# Altium schematic sheet Interface.SchDoc
size A4
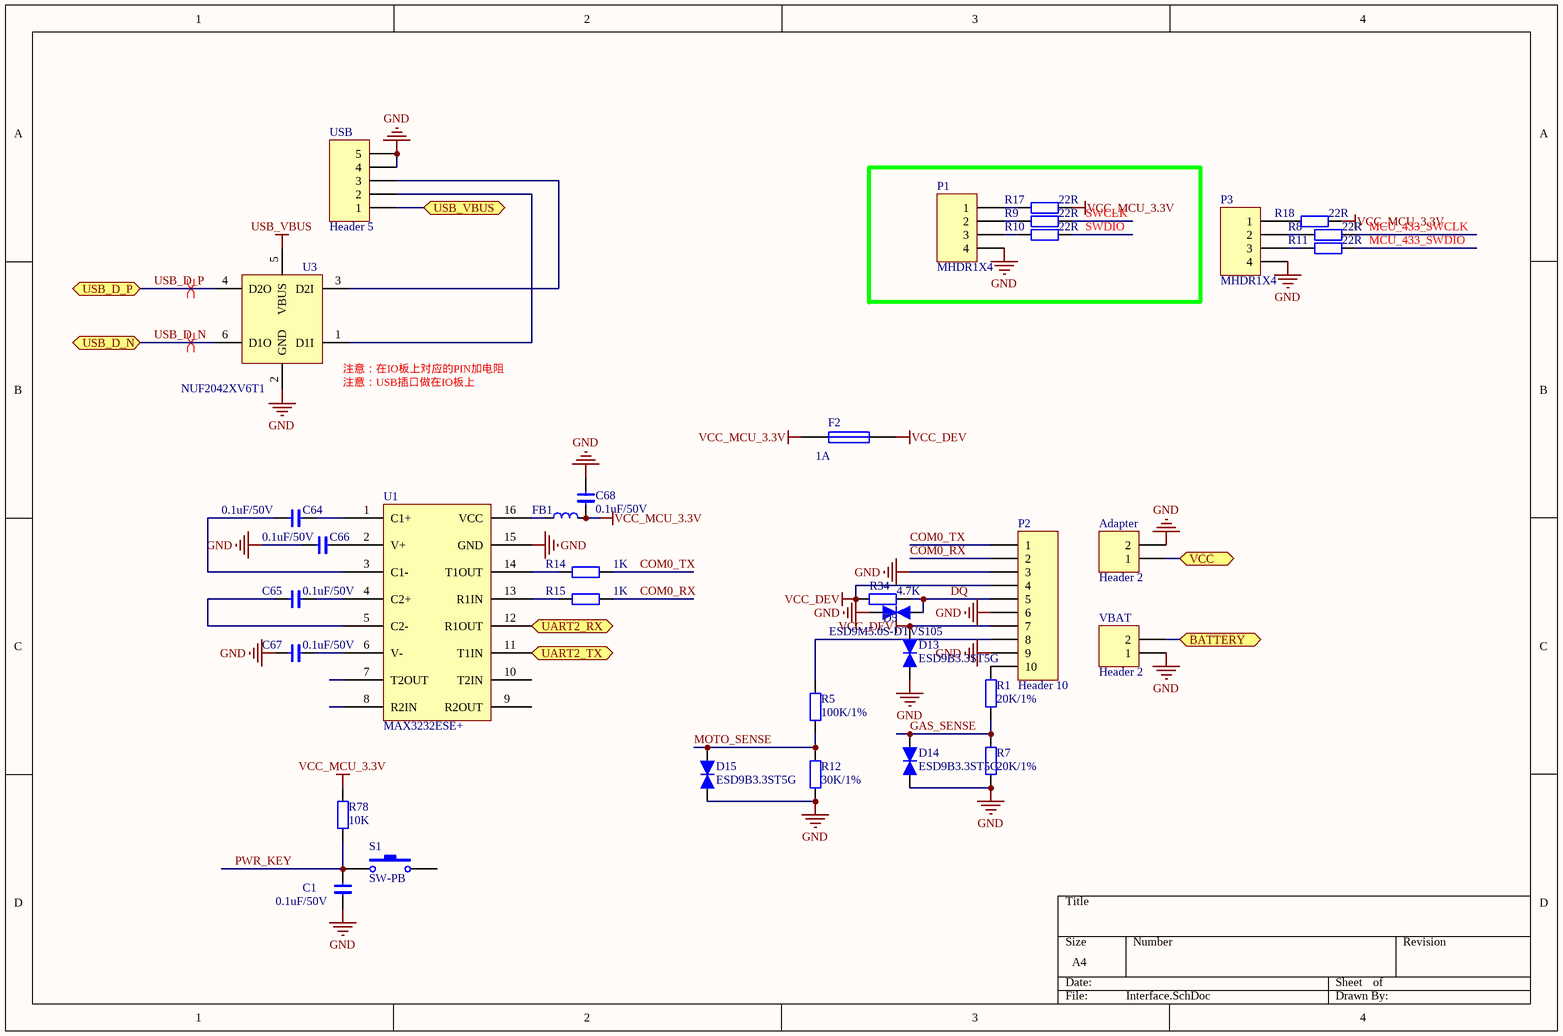
[diagram p0: Interface.SchDoc]

## Parts
Adapter  Header 2  [KF7.62-2P]
C1  0.1uF/50V  [0603C]
C64  0.1uF/50V  [0603C]
C65  0.1uF/50V  [0603C]
C66  0.1uF/50V  [0603C]
C67  0.1uF/50V  [0603C]
C68  0.1uF/50V  [0603C]
D5  ESD9M5.0S-DTVS105  [SOD923]
D13  ESD9B3.3ST5G  [SOD923]
D14  ESD9B3.3ST5G  [SOD923]
D15  ESD9B3.3ST5G  [SOD923]
F2  1A  [0805R]
FB1  (no value)  [0603R]
P1  MHDR1X4  [HDR1X4]
P2  Header 10  [10*2.54MMW]
P3  MHDR1X4  [HDR1X4]
R1  20K/1%  [0603R]
R5  100K/1%  [0603R]
R7  20K/1%  [0603R]
R8  22R  [0603R]
R9  22R  [0603R]
R10  22R  [0603R]
R11  22R  [0603R]
R12  30K/1%  [0603R]
R14  1K  [0603R]
R15  1K  [0603R]
R17  22R  [0603R]
R18  22R  [0603R]
R34  4.7K  [0603R]
R78  10K  [0603R]
S1  SW-PB  [KEY_SMT_4*4]
U1  MAX3232ESE+  [SOIC127P600X265-16N]
U3  NUF2042XV6T1  [SOT563-6]
USB  Header 5  [USB-MICRO-5P-2]
VBAT  Header 2  [2X2.54MM]

## Ports
BATTERY (bidir), UART2_RX (out), UART2_TX (in), USB_D_N, USB_D_P, USB_VBUS (bidir), VCC (bidir)

## Nets
GND: Adapter.2 C1.2 C66.2 C67.2 C68.1 D5.1(A) D13.1(A) D14.1(A) D15.1(A) P1.4 P2.3 P2.6 P2.9 P3.4 R7.1 R12.1 U1.15(GND) U3.2(GND) USB.4 USB.5 VBAT.1
USB_VBUS: U3.5(VBUS)
VCC_DEV: D13.2(K) F2.2 P2.4 P2.7 R34.2
VCC_MCU_3.3V: C68.2 F2.1 FB1.2 R17.1 R18.1 R78.1
BATTERY: VBAT.2 ; port BATTERY
COM0_RX: P2.2 R15.1
COM0_TX: P2.1 R14.1
DQ: D5.2(K) P2.5 R34.1
GAS_SENSE: D14.2(K) R1.1 R7.2
MCU_433_SWCLK: R8.1
MCU_433_SWDIO: R11.1
MOTO_SENSE: D15.2(K) R5.1 R12.2
PWR_KEY: C1.1 R78.2 S1.1
SWCLK: R9.1
SWDIO: R10.1
UART2_RX: U1.12(R1OUT) ; port UART2_RX
UART2_TX: U1.11(T1IN) ; port UART2_TX
USB_D_N: U3.6(D1O) ; port USB_D_N
USB_D_P: U3.4(D2O) ; port USB_D_P
USB_VBUS: USB.1 ; port USB_VBUS  [a separate net that carries the same name]
VCC: Adapter.1 ; port VCC
NetC64_1: C64.1 U1.1(C1+)
NetC64_2: C64.2 U1.3(C1-)
NetC65_1: C65.1 U1.4(C2+)
NetC65_2: C65.2 U1.5(C2-)
NetC66_1: C66.1 U1.2(V+)
NetC67_1: C67.1 U1.6(V-)
NetFB1_1: FB1.1 U1.16(VCC)
NetP1_1: P1.1 R17.2
NetP1_2: P1.2 R9.2
NetP1_3: P1.3 R10.2
NetP2_8: P2.8 R5.2
NetP2_10: P2.10 R1.2
NetP3_1: P3.1 R18.2
NetP3_2: P3.2 R8.2
NetP3_3: P3.3 R11.2
NetR14_2: R14.2 U1.14(T1OUT)
NetR15_2: R15.2 U1.13(R1IN)
NetU3_1: U3.1(D1I) USB.2
NetU3_3: U3.3(D2I) USB.3

Not connected (* = marked no-connect by the designer): S1 2; U1 7(T2OUT) 8(R2IN) 9(R2OUT) 10(T2IN)

## Layout directives
differential pair: USB_D_N, USB_D_P

## Notes on the sheet
- (near U3) 注意：在IO板上对应的PIN加电阻
- (near U3) 注意：USB插口做在IO板上

## Library data of the parts
Adapter VBAT = Header 2: Header, 2-Pin; LatestRevisionDate: 17-Jul-2002; LatestRevisionNote: Re-released for DXP Platform.; Publisher: Altium Limited
C1 C66 C68 = C: Value: 0.1uF
C64 C65 C67 = C
D13-D15 = ESD9M5.0S-DTVS105
F2 = Fuse 1: Fuse; Published: 8-Jun-2000; LatestRevisionDate: 17-Jul-2002; LatestRevisionNote: Re-released for DXP Platform.; PackageReference: PIN-W2/E2.8; Publisher: Altium Limited
FB1 = L_4: L; Part Field 1: VLF3014AT-2R2M1R2
P1 P3 = MHDR1X4: Header, 4-Pin; LatestRevisionDate: 17-Jul-2002; LatestRevisionNote: Re-released for DXP Platform.; Publisher: Altium Limited
P2 = Header 10: Header, 10-Pin; LatestRevisionDate: 17-Jul-2002; LatestRevisionNote: Re-released for DXP Platform.; Publisher: Altium Limited
R1 R5 R7 R12 R34 R78 = Res2: Resistor; Value: 1K; Published: 8-Jun-2000; LatestRevisionDate: 17-Jul-2002; LatestRevisionNote: Re-released for DXP Platform.; PackageReference: AXIAL-0.4; Publisher: Altium Limited
R8-R11 R17 R18 = Res2: Resistor; Published: 8-Jun-2000; LatestRevisionDate: 17-Jul-2002; LatestRevisionNote: Re-released for DXP Platform.; PackageReference: AXIAL-0.4; Publisher: Altium Limited; Value: 22R
R14 R15 = Res2: Resistor; Value: 22R; Published: 8-Jun-2000; LatestRevisionDate: 17-Jul-2002; LatestRevisionNote: Re-released for DXP Platform.; PackageReference: AXIAL-0.4; Publisher: Altium Limited
S1 = SW-PB: Switch; Published: 24-Mar-1999; LatestRevisionDate: 17-Jul-2002; LatestRevisionNote: Re-released for DXP Platform.; PackageReference: SPST-2; Publisher: Altium Limited
USB = Header 5: Header, 5-Pin; LatestRevisionDate: 17-Jul-2002; LatestRevisionNote: Re-released for DXP Platform.; Publisher: Altium Limited